# EAGLE design FootForceSensor_ver1_0 (EAGLE 9.6.2)
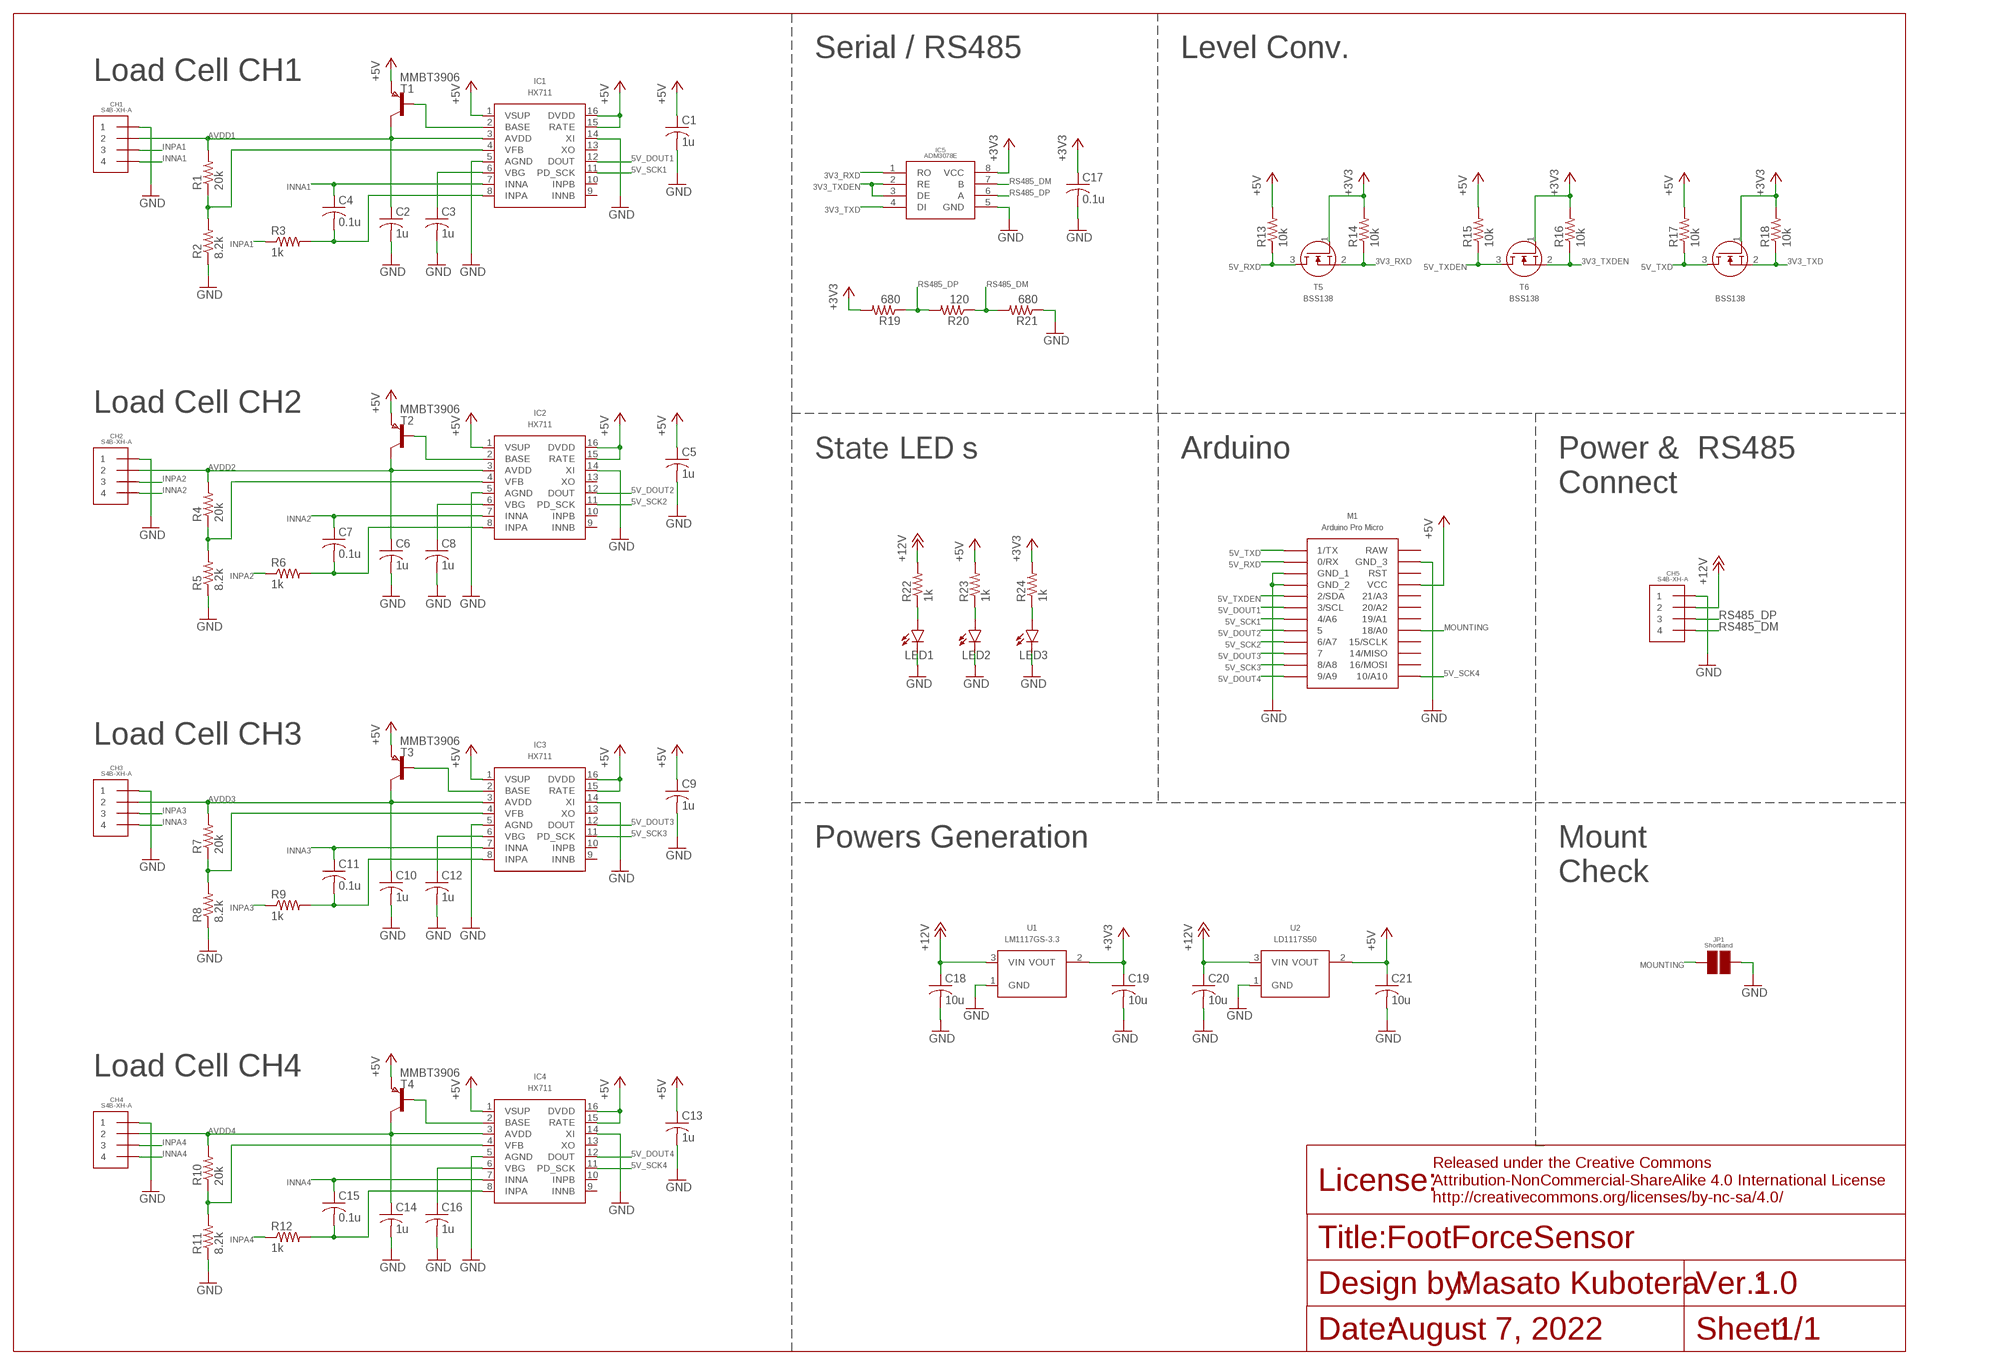
[diagram p0: schematic, sheet 1]

## Parts
C1  1u  C-USC0603  [C0603]
C2  1u  C-USC0603  [C0603]
C3  1u  C-USC0603  [C0603]
C4  0.1u  C-USC0603  [C0603]
C5  1u  C-USC0603  [C0603]
C6  1u  C-USC0603  [C0603]
C7  0.1u  C-USC0603  [C0603]
C8  1u  C-USC0603  [C0603]
C9  1u  C-USC0603  [C0603]
C10  1u  C-USC0603  [C0603]
C11  0.1u  C-USC0603  [C0603]
C12  1u  C-USC0603  [C0603]
C13  1u  C-USC0603  [C0603]
C14  1u  C-USC0603  [C0603]
C15  0.1u  C-USC0603  [C0603]
C16  1u  C-USC0603  [C0603]
C17  0.1u  C-USC0603  [C0603]
C18  10u  C-USC0603  [C0603]
C19  10u  C-USC0603  [C0603]
C20  10u  C-USC0603  [C0603]
C21  10u  C-USC0603  [C0603]
CH1  S4B-XH-A  [S4B-XH-A]
CH2  S4B-XH-A  [S4B-XH-A]
CH3  S4B-XH-A  [S4B-XH-A]
CH4  S4B-XH-A  [S4B-XH-A]
CH5  S4B-XH-A  [S4B-XH-A]
IC1  HX711  [HX711]
IC2  HX711  [HX711]
IC3  HX711  [HX711]
IC4  HX711  [HX711]
IC5  ADM3078E  [ADM3078E]
JP1  SHORTLAND  [SHORTLAND]
LED1  LEDSML0603  [SML0603]
LED2  LEDSML0603  [SML0603]
LED3  LEDSML0603  [SML0603]
M1  PRO_MICRO_THROUGH_HOLE  [PRO_MICRO_THROUGH_HOLE]
R1  20k  R-US_R0603  [R0603]
R2  8.2k  R-US_R0603  [R0603]
R3  1k  R-US_R0603  [R0603]
R4  20k  R-US_R0603  [R0603]
R5  8.2k  R-US_R0603  [R0603]
R6  1k  R-US_R0603  [R0603]
R7  20k  R-US_R0603  [R0603]
R8  8.2k  R-US_R0603  [R0603]
R9  1k  R-US_R0603  [R0603]
R10  20k  R-US_R0603  [R0603]
R11  8.2k  R-US_R0603  [R0603]
R12  1k  R-US_R0603  [R0603]
R13  10k  R-US_R0603  [R0603]
R14  10k  R-US_R0603  [R0603]
R15  10k  R-US_R0603  [R0603]
R16  10k  R-US_R0603  [R0603]
R17  10k  R-US_R0603  [R0603]
R18  10k  R-US_R0603  [R0603]
R19  680  R-US_R0603  [R0603]
R20  120  R-US_R0603  [R0603]
R21  680  R-US_R0603  [R0603]
R22  1k  R-US_R0603  [R0603]
R23  1k  R-US_R0603  [R0603]
R24  1k  R-US_R0603  [R0603]
T1  MMBT3906  PNPSOT23  [SOT-23]
T2  MMBT3906  PNPSOT23  [SOT-23]
T3  MMBT3906  PNPSOT23  [SOT-23]
T4  MMBT3906  PNPSOT23  [SOT-23]
T5  BSS138  [BSS138]
T6  BSS138  [BSS138]
T7  BSS138  [BSS138]
U1  LM1117GS-3.3  [SOT-223]
U2  LD1117S50  [SOT-223]

## Nets
3V3_LED [Power]: LED3.A R24.1
3V3_RXD [Signal]: IC5.1(RO) R14.1 T5.2(S)
3V3_TXD [Signal]: IC5.4(DI) R18.1 T7.2(S)
3V3_TXDEN [Signal]: IC5.2(RE) IC5.3(DE) R16.1 T6.2(S)
5V_DOUT1 [Signal]: IC1.12(DOUT) M1.3/SCL
5V_DOUT2 [Signal]: IC2.12(DOUT) M1.5
5V_DOUT3 [Signal]: IC3.12(DOUT) M1.7
5V_DOUT4 [Signal]: IC4.12(DOUT) M1.9/A9
5V_LED [Power]: LED2.A R23.1
5V_RXD [Signal]: M1.0/RX R13.1 T5.3(D)
5V_SCK1 [Signal]: IC1.11(PD_SCK) M1.4/A6
5V_SCK2 [Signal]: IC2.11(PD_SCK) M1.6/A7
5V_SCK3 [Signal]: IC3.11(PD_SCK) M1.8/A8
5V_SCK4 [Signal]: IC4.11(PD_SCK) M1.10/A10
5V_TXD [Signal]: M1.1/TX R17.1 T7.3(D)
5V_TXDEN [Signal]: M1.2/SDA R15.1 T6.3(D)
12V_LED [Power]: LED1.A R22.1
+3V3 [Power]: C17.1 C19.1 IC5.8(VCC) R14.2 R16.2 R18.2 R19.2 R24.2 T5.1(G) T6.1(G) T7.1(G) U1.2(VOUT)
+5V [Power]: C1.1 C5.1 C9.1 C13.1 C21.1 IC1.1(VSUP) IC1.15(RATE) IC1.16(DVDD) IC2.1(VSUP) IC2.15(RATE) IC2.16(DVDD) IC3.1(VSUP) IC3.15(RATE) IC3.16(DVDD) IC4.1(VSUP) IC4.15(RATE) IC4.16(DVDD) M1.VCC R13.2 R15.2 R17.2 R23.2 T1.2(E) T2.2(E) T3.2(E) T4.2(E) U2.2(VOUT)
+12V [Thick_Power]: C18.1 C20.1 CH5.2 R22.2 U1.3(VIN) U2.3(VIN)
AVDD1 [Signal]: C2.1 CH1.2 IC1.3(AVDD) R1.2 T1.1(C)
AVDD2 [Signal]: C6.1 CH2.2 IC2.3(AVDD) R4.2 T2.1(C)
AVDD3 [Signal]: C10.1 CH3.2 IC3.3(AVDD) R7.2 T3.1(C)
AVDD4 [Signal]: C14.1 CH4.2 IC4.3(AVDD) R10.2 T4.1(C)
BASE1 [Signal]: IC1.2(BASE) T1.3(B)
BASE2 [Signal]: IC2.2(BASE) T2.3(B)
BASE3 [Signal]: IC3.2(BASE) T3.3(B)
BASE4 [Signal]: IC4.2(BASE) T4.3(B)
GND: C1.2 C2.2 C3.2 C5.2 C6.2 C8.2 C9.2 C10.2 C12.2 C13.2 C14.2 C16.2 C17.2 C18.2 C19.2 C20.2 C21.2 CH1.1 CH2.1 CH3.1 CH4.1 CH5.1 IC1.5(AGND) IC1.14(XI) IC2.5(AGND) IC2.14(XI) IC3.5(AGND) IC3.14(XI) IC4.5(AGND) IC4.14(XI) IC5.5(GND) JP1.2 LED1.C LED2.C LED3.C M1.GND_1 M1.GND_2 M1.GND_3 R2.1 R5.1 R8.1 R11.1 R21.1 U1.1(GND) U2.1(GND)
INNA1 [Signal]: C4.1 CH1.4 IC1.7(INNA)
INNA2 [Signal]: C7.1 CH2.4 IC2.7(INNA)
INNA3 [Signal]: C11.1 CH3.4 IC3.7(INNA)
INNA4 [Signal]: C15.1 CH4.4 IC4.7(INNA)
INPA1 [Signal]: CH1.3 R3.1
INPA1_ [Signal]: C4.2 IC1.8(INPA) R3.2
INPA2 [Signal]: CH2.3 R6.1
INPA2_ [Signal]: C7.2 IC2.8(INPA) R6.2
INPA3 [Signal]: CH3.3 R9.1
INPA3_ [Signal]: C11.2 IC3.8(INPA) R9.2
INPA4 [Signal]: CH4.3 R12.1
INPA_ [Signal]: C15.2 IC4.8(INPA) R12.2
MOUNTING [Signal]: JP1.1 M1.18/A0
RS485_DM [Signal]: CH5.4 IC5.7(B) R20.1 R21.2
RS485_DP [Signal]: CH5.3 IC5.6(A) R19.1 R20.2
VBG1 [Signal]: C3.1 IC1.6(VBG)
VBG2 [Signal]: C8.1 IC2.6(VBG)
VBG3 [Signal]: C12.1 IC3.6(VBG)
VBG4 [Signal]: C16.1 IC4.6(VBG)
VFB1 [Signal]: IC1.4(VFB) R1.1 R2.2
VFB2 [Signal]: IC2.4(VFB) R4.1 R5.2
VFB3 [Signal]: IC3.4(VFB) R7.1 R8.2
VFB4 [Signal]: IC4.4(VFB) R10.1 R11.2
Unconnected: IC1.9(INNB) IC1.10(INPB) IC1.13(XO) IC2.9(INNB) IC2.10(INPB) IC2.13(XO) IC3.9(INNB) IC3.10(INPB) IC3.13(XO) IC4.9(INNB) IC4.10(INPB) IC4.13(XO) M1.14/MISO M1.15/SCLK M1.16_MOSI(16/MOSI) M1.19/A1 M1.20/A2 M1.21/A3 M1.RAW M1.RST

## Notes on the sheet
- Serial / RS485 | Level Conv.
- Load Cell CH1
- Load Cell CH2
- State LEDｓ | Arduino
- Power &  RS485
  Connect
- Load Cell CH3
- Powers Generation
- Mount
  Check
- Load Cell CH4
- FootForceSensor
- 1.0
- August 7, 2022 | 1/1

## Library data of the parts
C1-C21 = rcl:C-US: CAPACITOR, American symbol; SPICEPREFIX: C
CH1-CH5 = JST-XH:S4B-XH-A
IC1-IC4 = HX711:HX711
IC5 = ADM3078E:ADM3078E
JP1 = Shortland:SHORTLAND
LED1-LED3 = led:LED: LED OSRAM: - CHIPLED LG R971, LG N971, LY N971, LG Q971, LY Q971, LO R971, LY R971 LH N974, LH R974 LS Q976, LO Q976, LY Q976 LO Q996 - Hyper CHIPLED LW Q18S LB Q993, LB Q99A, LB R99A - SideLED LS A670, LO A670, LY A670, LG A670, LP A670 LB A673, LV A673, LT A673, LW A673 LH A674 LY A675 LS A676, LA A676, LO A676, LY A676, LW A676 LS A679, LY A679, LG A679 - Hyper Micro SIDELED® LS Y876, LA Y876, LO Y876, LY Y876 LT Y87S - SmartLED LW L88C, LW L88S LB L89C, LB L89S, LG L890 LS L89K, LO L89K, LY L89K LS L896, LA L896, LO L896, LY L896 - TOPLED LS T670, LO T670, LY T670, LG T670, LP T670 LSG T670, LSP T670, LSY T670, LOP T670, LYG T670 LG T671, LOG T671, LSG T671 LB T673, LV T673, LT T673, LW T673 LH T674 LS T676, LA T676, LO T676, LY T676, LB T676, LH T676, LSB T676, LW T676 LB T67C, LV T67C, LT T67C, LS T67K, LO T67K, LY T67K, LW E67C LS E67B, LA E67B, LO E67B, LY E67B, LB E67C, LV E67C, LT E67C LW T67C LS T679, LY T679, LG T679 LS T770, LO T770, LY T770, LG T770, LP T770 LB T773, LV T773, LT T773, LW T773 LH T774 LS E675, LA E675, LY E675, LS T675 LS T776, LA T776, LO T776, LY T776, LB T776 LHGB T686 LT T68C, LB T68C - Hyper Mini TOPLED® LB M676 - Mini TOPLED Santana® LG M470 LS M47K, LO M47K, LY M47K Source: http://www.osram.convergy.de LUXEON: - LUMILED® LXK2-PW12-R00, LXK2-PW12-S00, LXK2-PW14-U00, LXK2-PW14-V00 LXK2-PM12-R00, LXK2-PM12-S00, LXK2-PM14-U00 LXK2-PE12-Q00, LXK2-PE12-R00, LXK2-PE12-S00, LXK2-PE14-T00, LXK2-PE14-U00 LXK2-PB12-K00, LXK2-PB12-L00, LXK2-PB12-M00, LXK2-PB14-N00, LXK2-PB14-P00, LXK2-PB14-Q00 LXK2-PR12-L00, LXK2-PR12-M00, LXK2-PR14-Q00, LXK2-PR14-R00 LXK2-PD12-Q00, LXK2-PD12-R00, LXK2-PD12-S00 LXK2-PH12-R00, LXK2-PH12-S00 LXK2-PL12-P00, LXK2-PL12-Q00, LXK2-PL12-R00 Source: www.luxeon.com KINGBRIGHT: KA-3528ASYC Source: www.kingbright.com
M1 = Arduino:PRO_MICRO_THROUGH_HOLE
R1-R24 = rcl:R-US_: RESISTOR, American symbol; SPICEPREFIX: R
T1-T4 = zetex:PNPSOT23: PNP TRANSISTOR; MPN: DSS20200L-7; OC_FARNELL: unknown; OC_NEWARK: 25R4554
T5-T7 = BSS138:BSS138
U1 = LM1117GS-3.3:LM1117GS-3.3
U2 = LD1117S50:LD1117S50

## Net classes
0 default: width 0.203 mm
1 Power: width 0.254 mm
2 Thick_Power: width 0.406 mm
3 Signal: width 0.203 mm

## Board
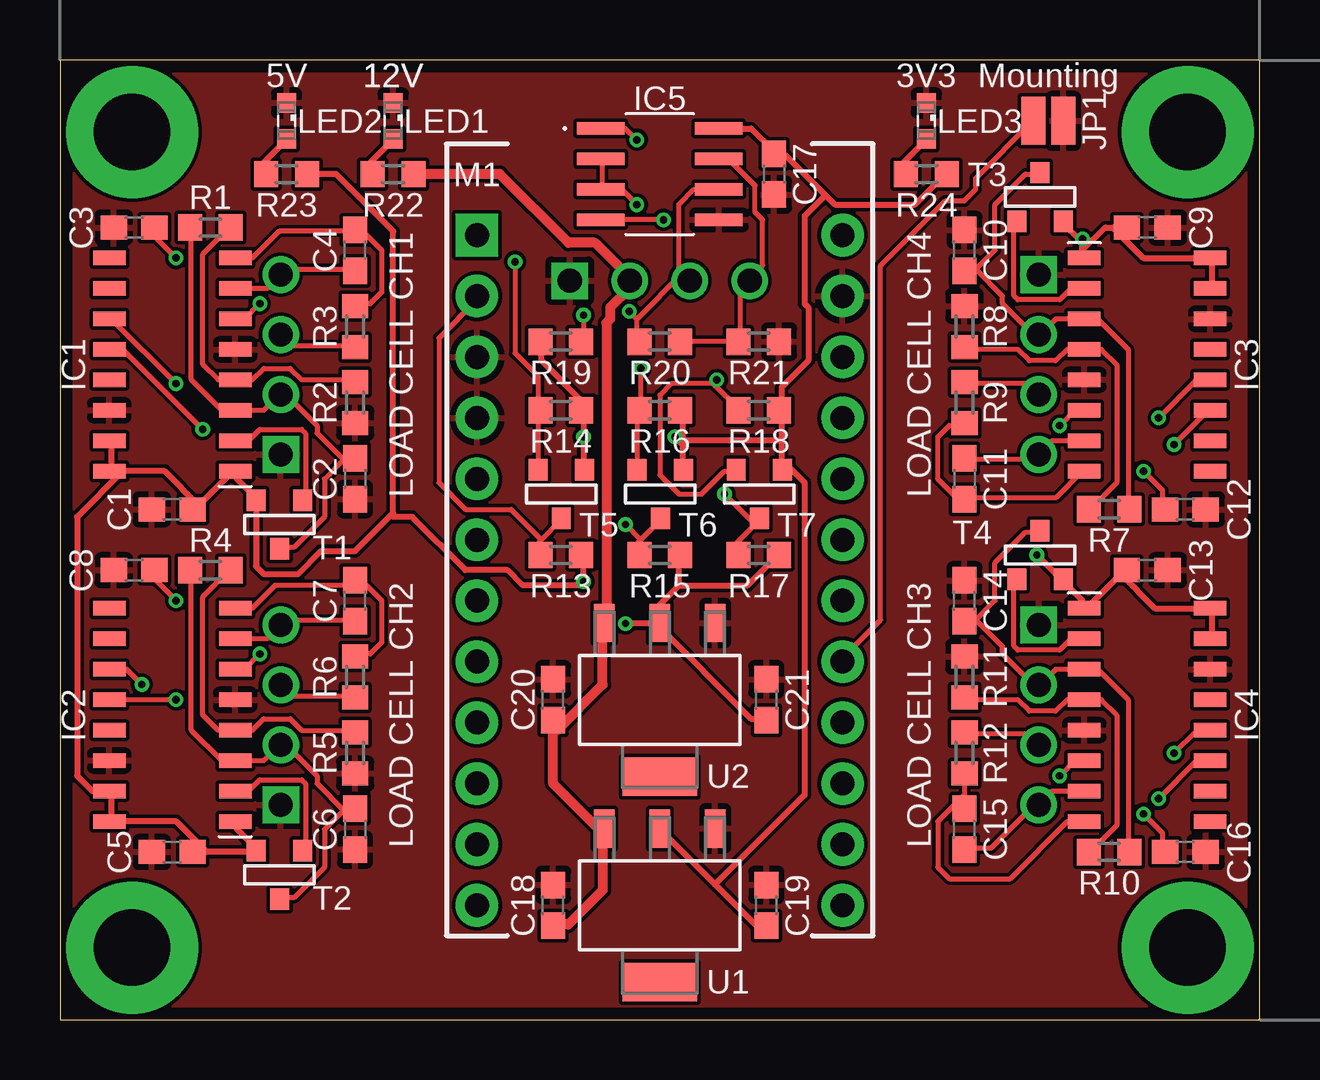
[diagram p1: board, top side]
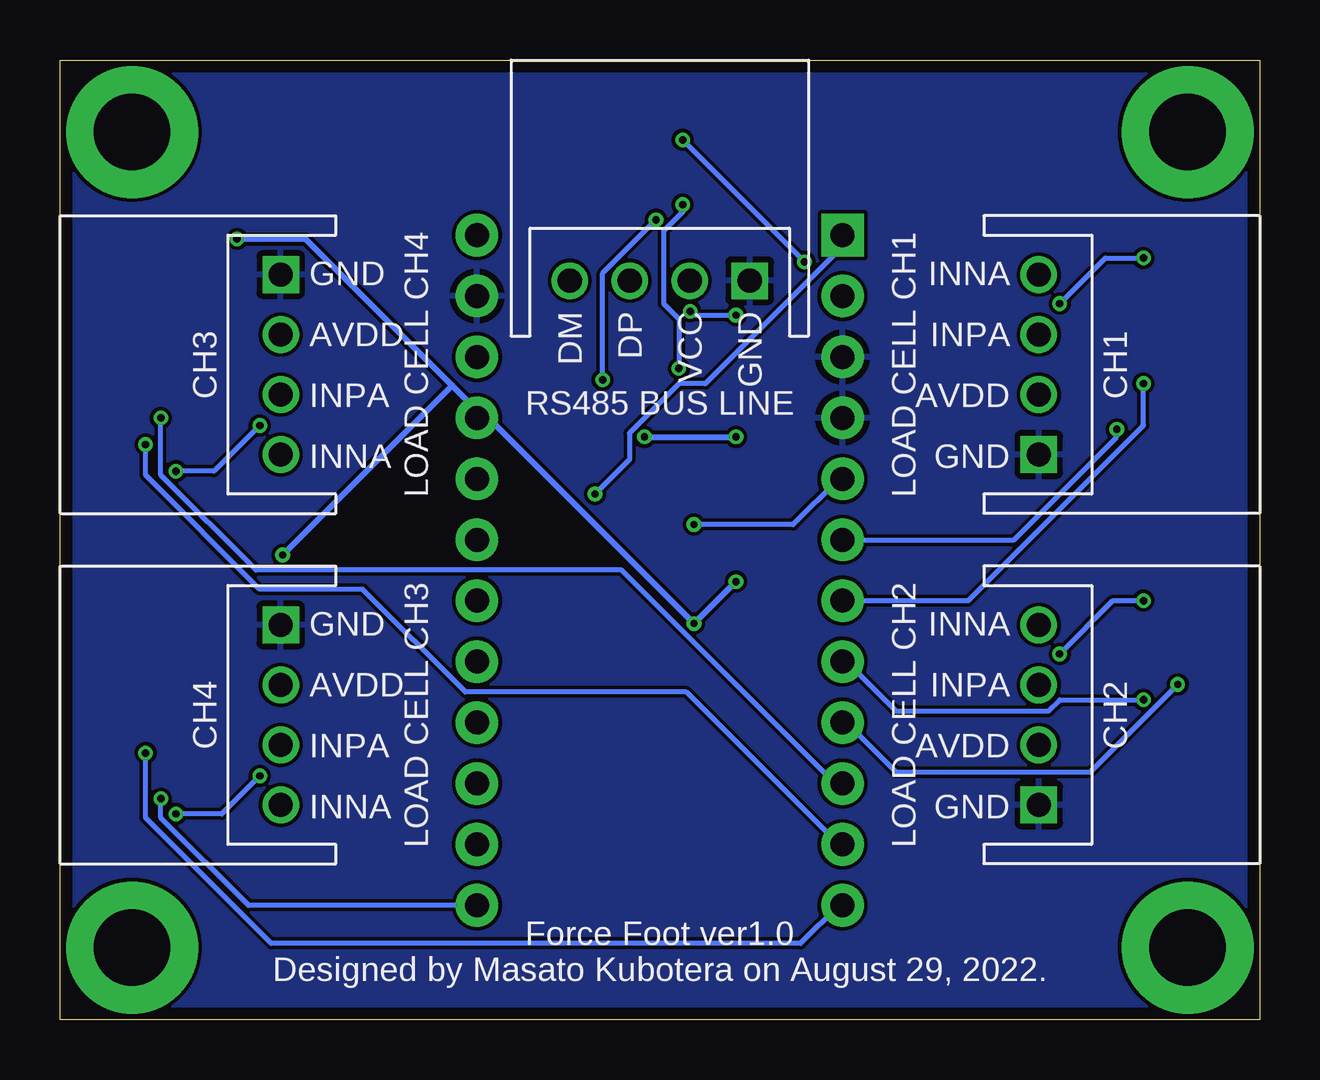
[diagram p2: board, bottom side, seen from below]

Size 50 x 40 mm. Coordinates in mm from the lower left corner, seen from the top.
Outline: 0,0 50,0 50,40 0,40 0,0
Copper layers (1*16): Top 0.035mm / dielectric 1.6mm / Bottom 0.035mm
Design rules "Elecrow_2-layer_PCB_eagle_rule": minimum track width 6mil, minimum drill 12mil, track to track 6mil, track to pad 6mil, pad to pad 6mil, via to via 8mil, smd to smd 0mil, copper to edge 20mil, drill to drill 10mil, minimum pad ring 6mil, minimum via ring 6mil, stop-mask expansion 0mil, vias tented up to drill 100mil, thermal gap 10mil

### Footprints (pad centres in the part's own frame; a part is rotated, then mirrored left to right if it is on the bottom)
C0603 = smd 1.1 x 1: 1 -0.85,0; 2 0.85,0
S4B-XH-A = drill 1.016 square: 1 3.75,0 | drill 1.016: 2 1.25,0; 3 -1.25,0; 4 -3.75,0
HX711 = smd 1.35 x 0.6: 1 -2.625,4.445; 2 -2.625,3.175; 3 -2.625,1.905; 4 -2.625,0.635; 5 -2.625,-0.635; 6 -2.625,-1.905; 7 -2.625,-3.175; 8 -2.625,-4.445; 9 2.625,-4.445; 10 2.625,-3.175; 11 2.625,-1.905; 12 2.625,-0.635; 13 2.625,0.635; 14 2.625,1.905; 15 2.625,3.175; 16 2.625,4.445
ADM3078E = smd 1.981 x 0.533: 1 -2.464,1.905; 2 -2.464,0.635; 3 -2.464,-0.635; 4 -2.464,-1.905; 5 2.464,-1.905; 6 2.464,-0.635; 7 2.464,0.635; 8 2.464,1.905
SHORTLAND = smd 1 x 2: 1 -0.625,0; 2 0.625,0
SML0603 = smd 0.8 x 0.8: A 0.75,0; C -0.75,0
PRO_MICRO_THROUGH_HOLE = drill 1 pad 1.778: 0/RX -7.62,11.43; 2/SDA -7.62,3.81; 3/SCL -7.62,1.27; 4/A6 -7.62,-1.27; 5 -7.62,-3.81; 6/A7 -7.62,-6.35; 7 -7.62,-8.89; 8/A8 -7.62,-11.43; 9/A9 -7.62,-13.97; 10/A10 7.62,-13.97; 14/MISO 7.62,-8.89; 15/SCLK 7.62,-6.35; 16_MOSI 7.62,-11.43; 18/A0 7.62,-3.81; 19/A1 7.62,-1.27; 20/A2 7.62,1.27; 21/A3 7.62,3.81; GND_1 -7.62,8.89; GND_2 -7.62,6.35; GND_3 7.62,11.43; RAW 7.62,13.97; RST 7.62,8.89; VCC 7.62,6.35 | drill 1 pad 1.778 square: 1/TX -7.62,13.97
R0603 = smd 1 x 1.1: 1 -0.85,0; 2 0.85,0
SOT-23 = smd 0.787 x 0.889: 1 0.025,-1.016; 2 -0.94,1.016; 3 0.991,1.016
BSS138 = smd 0.787 x 0.889: 1 0.991,1.016; 2 -0.94,1.016; 3 0.025,-1.016
SOT-223 = smd 1.6 x 0.838: 1 -3.2,2.311; 2 -3.2,0; 3 -3.2,-2.311 | smd 1.6 x 3.099: 4 3.2,0

### Placement (x,y rotation side)
C1  4.68,21.27 180 top
C2  12.3,22.54 270 top
C3  3.09,33.02 180 top
C4  12.3,32.06 90 top
C5  4.68,6.98 180 top
C6  12.3,7.94 270 top
C7  12.3,17.46 90 top
C8  3.09,18.73 180 top
C9  45.32,33.02 0 top
C10  37.7,32.06 90 top
C11  37.7,22.54 270 top
C12  46.91,21.27 0 top
C13  45.32,18.73 0 top
C14  37.7,17.46 90 top
C15  37.7,7.94 90 top
C16  46.91,6.98 0 top
C17  29.76,35.24 270 top
C18  20.55,4.76 90 top
C19  29.45,4.76 90 top
C20  20.55,13.33 90 top
C21  29.45,13.33 90 top
CH1  9.2,27.3 270 bottom
CH2  9.2,12.7 270 bottom
CH3  40.8,27.3 90 bottom
CH4  40.8,12.7 90 bottom
CH5  25,30.8 0 bottom
IC1  4.68,27.3 180 top
IC2  4.68,12.7 180 top
IC3  45.32,27.3 0 top
IC4  45.32,12.7 0 top
IC5  25,35.24 0 top
JP1  41.19,37.46 0 top
LED1  13.89,37.46 270 top
LED2  9.44,37.46 270 top
LED3  36.11,37.46 270 top
M1  25,18.73 0 top
R1  6.27,33.02 180 top
R2  12.3,25.71 90 top
R3  12.3,28.89 90 top
R4  6.27,18.73 180 top
R5  12.3,11.11 90 top
R6  12.3,14.29 90 top
R7  43.73,21.27 0 top
R8  37.7,28.89 270 top
R9  37.7,25.71 270 top
R10  43.73,6.98 0 top
R11  37.7,14.29 270 top
R12  37.7,11.11 270 top
R13  20.87,19.36 0 top
R14  20.87,25.4 0 top
R15  25,19.36 0 top
R16  25,25.4 0 top
R17  29.13,19.36 0 top
R18  29.13,25.4 0 top
R19  20.87,28.26 180 top
R20  25,28.26 180 top
R21  29.13,28.26 180 top
R22  13.89,35.24 0 top
R23  9.44,35.24 0 top
R24  36.11,35.24 0 top
T1  9.12,20.64 0 top
T2  9.12,6.03 0 top
T3  40.88,34.29 180 top
T4  40.88,19.36 180 top
T5  20.87,21.91 0 top
T6  25,21.91 0 top
T7  29.13,21.91 0 top
U1  25,4.76 270 top
U2  25,13.33 270 top

### Tracks (layer width: path | path; a pad name or v marks a point on that pad's centre or on a via)
3V3_LED
  Top 0.254: LED3.A 36.11,36.67 35.16,35.72 35.16,35.24 R24.1
3V3_RXD  (via drill 0.3)
  Top 0.203: 19.92,25.4 19.92,23.02 T5.2 | 19.92,25.4 19.92,26.83 18.97,27.78 v18.97,31.59 | v24.05,36.67 23.57,37.14 IC5.1 | 19.92,25.4 R14.1
  Bottom 0.203: v24.05,36.67 v18.97,31.59
3V3_TXD  (via drill 0.3)
  Top 0.203: 27.22,26.51 25.48,26.51 25,26.03 25,22.7 25.79,21.91 26.75,21.91 27.7,22.86 28.18,22.86 T7.2 | 27.22,26.51 28.33,25.4 R18.1 | v25.16,33.34 IC5.4 | 27.22,26.51 v27.38,26.67
  Bottom 0.203: v25.16,33.34 27.38,31.11 v27.38,26.67
3V3_TXDEN  (via drill 0.3)
  Top 0.203: T6.2 24.05,23.02 24.05,25.4 R16.1 24.21,25.4 v24.21,27.14 | v24.05,33.97 23.41,34.61 22.62,34.61 | 22.62,34.61 22.62,35.88 IC5.2 | 22.62,34.61 IC5.3
  Bottom 0.203: v24.21,27.14 24.21,29.21 24.84,29.84 24.84,32.86 24.05,33.65 v24.05,33.97
5V_DOUT1  (via drill 0.3)
  Top 0.203: IC1.12 2.62,27.94 v5.95,24.6
  Bottom 0.203: v5.95,24.6 5.95,24.29 10.24,20 M1.3/SCL
5V_DOUT2  (via drill 0.3)
  Top 0.203: v4.84,13.33 IC2.12
  Bottom 0.203: v4.84,13.33 8.33,13.33 8.81,12.86 15.16,12.86 17.22,14.92 M1.5
5V_DOUT3  (via drill 0.3)
  Top 0.203: IC3.12 47.38,26.67 v45.8,25.08
  Bottom 0.203: v45.8,25.08 45.8,22.7 41.83,18.73 26.59,18.73 17.7,9.84 M1.7
5V_DOUT4  (via drill 0.3)
  Top 0.203: IC4.12 47.38,12.06 v46.43,11.11
  Bottom 0.203: v46.43,11.11 46.43,8.41 41.19,3.17 19.13,3.17 17.54,4.76 M1.9/A9
5V_LED
  Top 0.254: LED2.A 9.44,36.67 8.49,35.72 8.49,35.24 R23.1
5V_RXD
  Top 0.203: 20.08,20 19.92,19.84 19.92,19.36 R13.1 | 20.08,20 20.87,20.79 T5.3 | 20.08,20 18.81,21.27 16.9,21.27 15.79,22.38 15.79,28.41 17.38,30 M1.0/RX
5V_SCK1  (via drill 0.3)
  Top 0.203: v4.84,26.51 2.14,29.21 IC1.11
  Bottom 0.203: v4.84,26.51 4.84,24.76 12.14,17.46 M1.4/A6
5V_SCK2  (via drill 0.3)
  Top 0.203: IC2.11 2.77,14.6 v3.41,13.97
  Bottom 0.203: v3.41,13.97 7.06,10.32 15.16,10.32 17.22,12.38 M1.6/A7
5V_SCK3  (via drill 0.3)
  Top 0.203: v46.43,23.97 47.86,25.4 IC3.11
  Bottom 0.203: v46.43,23.97 46.43,22.7 41.67,17.94 37.38,17.94 33.1,13.65 23.89,13.65 17.54,7.3 M1.8/A8
5V_SCK4  (via drill 0.3)
  Top 0.203: IC4.11 47.38,10.79 v45.8,9.21
  Bottom 0.203: v45.8,9.21 45.8,8.41 42.14,4.76 M1.10/A10
5V_TXD  (via drill 0.3)
  Top 0.203: 28.97,20.64 28.18,19.84 28.18,19.36 R17.1 | 28.97,20.64 29.13,20.79 T7.3 28.97,20.64 | v27.7,21.91 28.97,20.64
  Bottom 0.203: v27.7,21.91 26.27,23.33 26.27,24.45 24.21,26.51 23.09,26.51 17.38,32.22 M1.1/TX
5V_TXDEN  (via drill 0.3)
  Top 0.203: 24.21,20 24.05,19.84 24.05,19.36 R15.1 | 24.21,20 25,20.79 T6.3 | v23.57,20.64 24.21,20
  Bottom 0.203: v23.57,20.64 19.44,20.64 17.54,22.54 M1.2/SDA
12V_LED
  Top 0.254: LED1.A 13.89,36.67 12.94,35.72 12.94,35.24 R22.1
+3V3  (via drill 0.3)
  Top 0.254: 27.3,5.63 25,7.94 U1.2 | 27.3,5.63 28.97,3.97 29.45,3.97 C19.1 | T5.1 21.82,23.02 v21.82,24.29 21.82,25.4 R14.2 21.67,25.4 21.67,25.87 20.08,27.46 20.08,28.26 R19.2 | 25.95,24.13 25.95,25.4 R16.2 | 25.95,24.13 25.95,23.97 | 25.95,23.97 25.95,23.02 T6.1 | 30.08,25.4 30.08,24.13 | 30.08,24.13 30.08,23.33 | 30.08,23.33 30.08,23.02 T7.1 30.08,23.33 | 30.08,24.13 25.95,24.13 | IC5.8 28.81,37.14 29.76,36.19 C17.1 29.76,36.03 30.24,36.03 31.91,34.37 | 31.91,34.37 32.3,33.97 35.64,33.97 36.91,35.24 R24.2 | 30.08,25.4 30.08,26.35 31.19,27.46 31.19,29.68 31.03,29.84 31.03,33.49 31.91,34.37 | 30.08,25.4 R18.2 | 25.95,23.97 v25.64,24.29 | 27.3,5.63 31.03,9.36 31.03,22.38 30.08,23.33
  Bottom 0.254: v25.64,24.29 v21.82,24.29
+5V  (via drill 0.3)
  Top 0.254: 2.14,8.25 2.14,9.52 IC2.15 1.35,9.52 0.71,10.16 0.71,20.95 2.62,22.86 | IC2.1 7.38,8.25 7.38,7.94 8.17,7.14 T2.2 8.17,6.98 6.11,6.98 | 6.11,6.98 C5.1 | 2.14,8.25 4.84,8.25 6.11,6.98 | 2.14,8.25 IC2.16 | 2.14,22.86 2.14,24.13 IC1.15 | 5.79,21.43 7.22,22.86 IC1.1 7.38,22.86 7.38,22.54 8.17,21.75 T1.2 8.17,21.59 8.17,18.89 8.49,18.57 9.92,18.57 10.87,19.52 12.3,19.52 13.81,21.03 | 5.79,21.43 5.63,21.27 C1.1 5.79,21.43 | R23.2 11.51,35.24 13.89,32.86 13.89,21.11 13.81,21.03 | 2.62,22.86 4.36,22.86 5.79,21.43 | 2.62,22.86 2.14,22.86 | 2.14,22.86 IC1.16 | IC4.15 48.02,15.87 48.02,17.14 IC4.16 45.64,17.14 44.21,18.57 | 44.21,18.57 42.78,17.14 IC4.1 42.62,17.14 42.62,17.46 41.83,18.25 T4.2 41.67,18.41 v40.72,19.36 | 44.21,18.57 44.37,18.73 C13.1 44.21,18.57 | IC3.15 48.02,30.48 48.02,31.75 IC3.16 45.16,31.75 43.89,33.02 | 42.54,32.46 42.62,32.38 42.62,32.06 | 42.54,32.46 41.83,33.18 T3.2 | 42.62,32.06 42.62,31.75 IC3.1 | 43.89,33.02 43.57,33.02 42.62,32.06 | 43.89,33.02 C9.1 | 24.84,16.51 25,16.51 U2.2 | 24.84,16.51 v23.57,16.51 | R13.2 21.82,19.36 v21.82,18.25 21.67,18.09 19.29,18.09 18.65,18.73 16.9,18.73 14.68,20.95 13.89,20.95 13.81,21.03 | 25.79,18.09 25.79,19.36 R15.2 | 25.79,18.09 25,17.3 U2.2 | 24.84,16.51 28.81,12.54 29.45,12.54 C21.1 | 24.84,16.51 U2.2 | 25.79,18.09 28.65,18.09 29.92,19.36 R17.2 | v42.62,32.54 42.54,32.46
  Bottom 0.254: v21.82,18.25 v23.57,16.51 32.14,25.08 32.3,25.08 | v42.62,32.54 39.76,32.54 33.65,26.43 | 32.3,25.08 33.65,26.43 | 32.3,25.08 M1.VCC | 33.65,26.43 v40.72,19.36
+12V
  Top 0.406: C18.1 20.55,3.97 21.19,3.97 22.62,5.39 22.62,7.94 U1.3 22.46,7.94 20.55,9.84 C20.1 20.71,12.06 22.62,13.97 22.62,16.51 U2.3 22.78,16.67 22.78,29.05 22.94,29.21 22.94,29.68 23.73,30.48 23.73,30.64 CH5.2 23.73,30.95 22.3,32.38 21.19,32.38 18.33,35.24 R22.2
AVDD1
  Top 0.203: 11.82,23.33 11.03,22.54 11.03,20.95 9.76,19.68 9.28,19.68 T1.1 | 11.82,23.33 12.3,23.33 C2.1 11.82,23.33 | R1.2 5.47,33.02 5.47,26.67 6.74,25.4 IC1.3 8.49,25.4 9.12,26.03 CH1.2 9.28,26.19 10.71,24.76 10.71,24.45 11.82,23.33
AVDD2
  Top 0.203: 11.82,8.73 11.03,7.94 11.03,6.35 9.76,5.08 9.28,5.08 T2.1 | 11.82,8.73 12.3,8.73 C6.1 11.82,8.73 | R4.2 5.47,18.73 5.47,12.06 6.74,10.79 IC2.3 8.49,10.79 9.12,11.43 CH2.2 9.28,11.59 10.71,10.16 10.71,9.84 11.82,8.73
AVDD3
  Top 0.203: 38.18,31.27 38.97,32.06 38.97,33.97 40.24,35.24 40.72,35.24 T3.1 | 38.18,31.27 37.7,31.27 C10.1 38.18,31.27 | R7.2 44.53,21.27 44.53,27.94 43.26,29.21 IC3.3 41.51,29.21 40.88,28.57 CH3.2 40.72,28.41 39.29,29.84 39.29,30.16 38.18,31.27
AVDD4
  Top 0.203: 38.18,16.67 38.97,17.46 38.97,19.05 40.24,20.32 40.72,20.32 T4.1 | 38.18,16.67 37.7,16.67 C14.1 38.18,16.67 | R10.2 44.53,6.98 44.53,13.33 43.26,14.6 IC4.3 41.51,14.6 40.88,13.97 CH4.2 40.72,13.81 39.29,15.24 39.29,15.55 38.18,16.67
BASE1
  Top 0.203: IC1.2 7.86,24.13 8.33,24.6 10.08,24.6 10.24,24.45 10.24,21.75 T1.3
BASE2
  Top 0.203: IC2.2 7.86,9.52 8.33,10 10.08,10 10.24,9.84 10.24,7.14 T2.3
BASE3
  Top 0.203: IC3.2 42.14,30.48 41.67,30 39.92,30 39.76,30.16 39.76,33.18 T3.3
BASE4
  Top 0.203: IC4.2 42.14,15.87 41.67,15.4 39.92,15.4 39.76,15.55 39.76,18.25 T4.3
GND
  pour Top: -0.4,40.32 -0.4,-0.32 50.4,-0.32 50.4,40.32
  pour Bottom: -1.04,40.95 -1.04,-0.95 51.03,-0.95 51.03,40.95
HOLE1  (via drill 3.2 pad 5.5)
  other vias: 3,37
HOLE2  (via drill 3.2 pad 5.5)
  other vias: 3,3
HOLE3  (via drill 3.2 pad 5.5)
  other vias: 47,37
HOLE4  (via drill 3.2 pad 5.5)
  other vias: 47,3
INNA1
  Top 0.203: C4.1 12.3,31.27 9.44,31.27 9.28,31.11 CH1.4 9.12,30.95 8.65,30.48 IC1.7
INNA2
  Top 0.203: C7.1 12.3,16.67 9.44,16.67 9.28,16.51 CH2.4 9.12,16.35 8.65,15.87 IC2.7
INNA3
  Top 0.203: C11.1 37.7,23.33 40.56,23.33 40.72,23.49 CH3.4 40.88,23.65 41.35,24.13 IC3.7
INNA4
  Top 0.203: C15.1 37.7,7.14 38.81,7.14 40.72,9.05 CH4.4 40.88,9.05 41.35,9.52 IC4.7
INPA1
  Top 0.203: R3.1 12.3,28.1 9.6,28.1 9.28,28.41 CH1.3
INPA1_
  Top 0.203: 12.3,32.86 12.62,32.86 13.41,32.06 13.41,30.32 12.94,29.84 12.3,29.84 R3.2 | IC1.8 8.01,31.75 9.12,32.86 12.3,32.86 | 12.3,32.86 C4.2
INPA2
  Top 0.203: R6.1 12.3,13.49 9.6,13.49 9.28,13.81 CH2.3
INPA2_
  Top 0.203: 12.78,18.09 12.62,18.25 12.3,18.25 C7.2 12.78,18.09 | 12.78,18.09 13.41,17.46 13.41,15.71 12.94,15.24 12.3,15.24 R6.2 | IC2.8 8.01,17.14 8.97,18.09 12.78,18.09
INPA3
  Top 0.203: R9.1 37.7,26.51 40.4,26.51 40.72,26.19 CH3.3
INPA3_
  Top 0.203: 37.7,21.75 41.51,21.75 42.62,22.86 IC3.8 | 37.7,21.75 37.38,21.75 36.59,22.54 36.59,24.29 37.06,24.76 37.7,24.76 R9.2 | 37.7,21.75 C11.2
INPA4
  Top 0.203: R12.1 37.7,11.9 40.4,11.9 40.72,11.59 CH4.3
INPA_
  Top 0.203: R12.2 37.7,9.36 | 37.7,9.36 C15.2 | IC4.8 41.99,8.25 39.61,5.87 37.06,5.87 36.59,6.35 36.59,8.25 37.7,9.36
MOUNTING
  Top 0.203: M1.18/A0 32.62,15.08 34.21,16.67 34.21,31.43 36.91,34.13 37.7,34.13 38.18,34.61 38.18,35.08 40.56,37.46 JP1.1
RS485_DM
  Top 0.203: R20.1 R21.2 28.33,28.26 28.33,30.48 28.65,30.8 CH5.4 28.81,30.95 29.29,31.43 29.29,33.34 28.97,33.65 28.97,34.76 27.86,35.88 IC5.7
RS485_DP  (via drill 0.3)
  Top 0.203: v21.82,29.37 21.82,28.26 R19.1 | 24.05,29.21 v23.73,29.52 | 24.05,29.21 24.05,28.26 R20.2 | IC5.6 26.43,34.61 25.79,33.97 25.79,31.27 25.95,31.11 | 25.95,31.11 26.11,30.95 CH5.3 25.95,31.11 | 25.95,31.11 24.05,29.21
  Bottom 0.203: v21.82,29.37 23.57,29.37 v23.73,29.52
VBG1  (via drill 0.3)
  Top 0.203: v4.84,31.75 4.05,32.54 4.05,33.02 C3.1 | v8.33,29.84 7.7,29.21 IC1.6
  Bottom 0.203: v4.84,31.75 6.43,31.75 v8.33,29.84
VBG2  (via drill 0.3)
  Top 0.203: v4.84,17.46 4.05,18.25 4.05,18.73 C8.1 | v8.33,15.24 7.7,14.6 IC2.6
  Bottom 0.203: v4.84,17.46 6.11,17.46 v8.33,15.24
VBG3  (via drill 0.3)
  Top 0.203: v45.16,22.86 45.95,22.06 45.95,21.27 C12.1 | v41.67,24.76 42.3,25.4 IC3.6
  Bottom 0.203: v45.16,22.86 43.57,22.86 v41.67,24.76
VBG4  (via drill 0.3)
  Top 0.203: v45.16,8.57 45.95,7.78 45.95,6.98 C16.1 | v41.67,10.16 42.3,10.79 IC4.6
  Bottom 0.203: v45.16,8.57 43.26,8.57 v41.67,10.16
VFB1
  Top 0.203: R1.1 7.06,33.02 5.95,31.91 5.95,27.3 6.59,26.67 IC1.4 8.01,26.67 8.49,27.14 9.6,27.14 10.08,26.67 12.3,26.67 R2.2
VFB2
  Top 0.203: R4.1 7.06,18.73 5.95,17.62 5.95,12.7 6.59,12.06 IC2.4 8.01,12.06 8.49,12.54 9.6,12.54 10.08,12.06 12.3,12.06 R5.2
VFB3
  Top 0.203: R7.1 42.94,21.27 44.05,22.38 44.05,27.3 43.41,27.94 IC3.4 41.99,27.94 41.51,27.46 40.4,27.46 39.92,27.94 37.7,27.94 R8.2
VFB4
  Top 0.203: R10.1 42.94,6.98 44.05,8.09 44.05,12.7 43.41,13.33 IC4.4 41.99,13.33 41.51,12.86 40.4,12.86 39.92,13.33 37.7,13.33 R11.2

### Text on the board
tPlace: 5V | 12V | 12V | 3V3 | Mounting | LOAD CELL CH1 | LOAD CELL CH4 | LOAD CELL CH2 | LOAD CELL CH3
bPlace: INNA | GND | GND | VCC | DP | DM | INPA | AVDD | LOAD CELL CH1 | LOAD CELL CH4 | AVDD | RS485 BUS LINE | INPA | GND | INNA | INNA | GND | INPA | AVDD | LOAD CELL CH2 | LOAD CELL CH3 | AVDD | INPA | GND | INNA | Force Foot ver1.0 / Designed by Masato Kubotera on August 29, 2022.